# Altium schematic sheet Port.SchDoc
size A
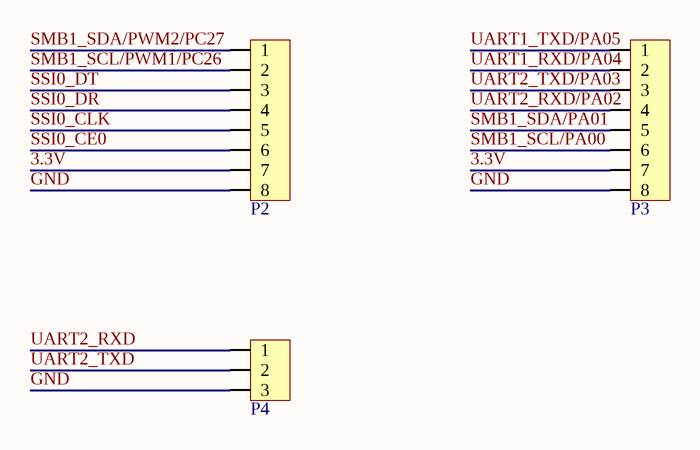
[diagram p0: Port.SchDoc]

## Parts
P2  HDR1x8_2.54  [HDR1X8_2.54_180]  (value not drawn)
P3  HDR1x8_2.54  [HDR1X8_2.54_180]  (value not drawn)
P4  HDR1x3_2.54  [HDR1X3_2.54_180]  (value not drawn)

## Nets
3.3V: P2.7 P3.7
GND: P2.8 P3.8 P4.3
SMB1_SCL/PA00: P3.6
SMB1_SCL/PWM1/PC26: P2.2
SMB1_SDA/PA01: P3.5
SMB1_SDA/PWM2/PC27: P2.1
SSI0_CE0: P2.6
SSI0_CLK: P2.5
SSI0_DR: P2.4
SSI0_DT: P2.3
UART1_RXD/PA04: P3.2
UART1_TXD/PA05: P3.1
UART2_RXD: P4.1
UART2_RXD/PA02: P3.4
UART2_TXD: P4.2
UART2_TXD/PA03: P3.3

## Library data of the parts
P2 P3 = HDR1x8_2.54: Header
P4 = HDR1x3_2.54: Header